# Altium schematic sheet JQ8900-16P语音模块原理图v1.1.SchDoc
size A3
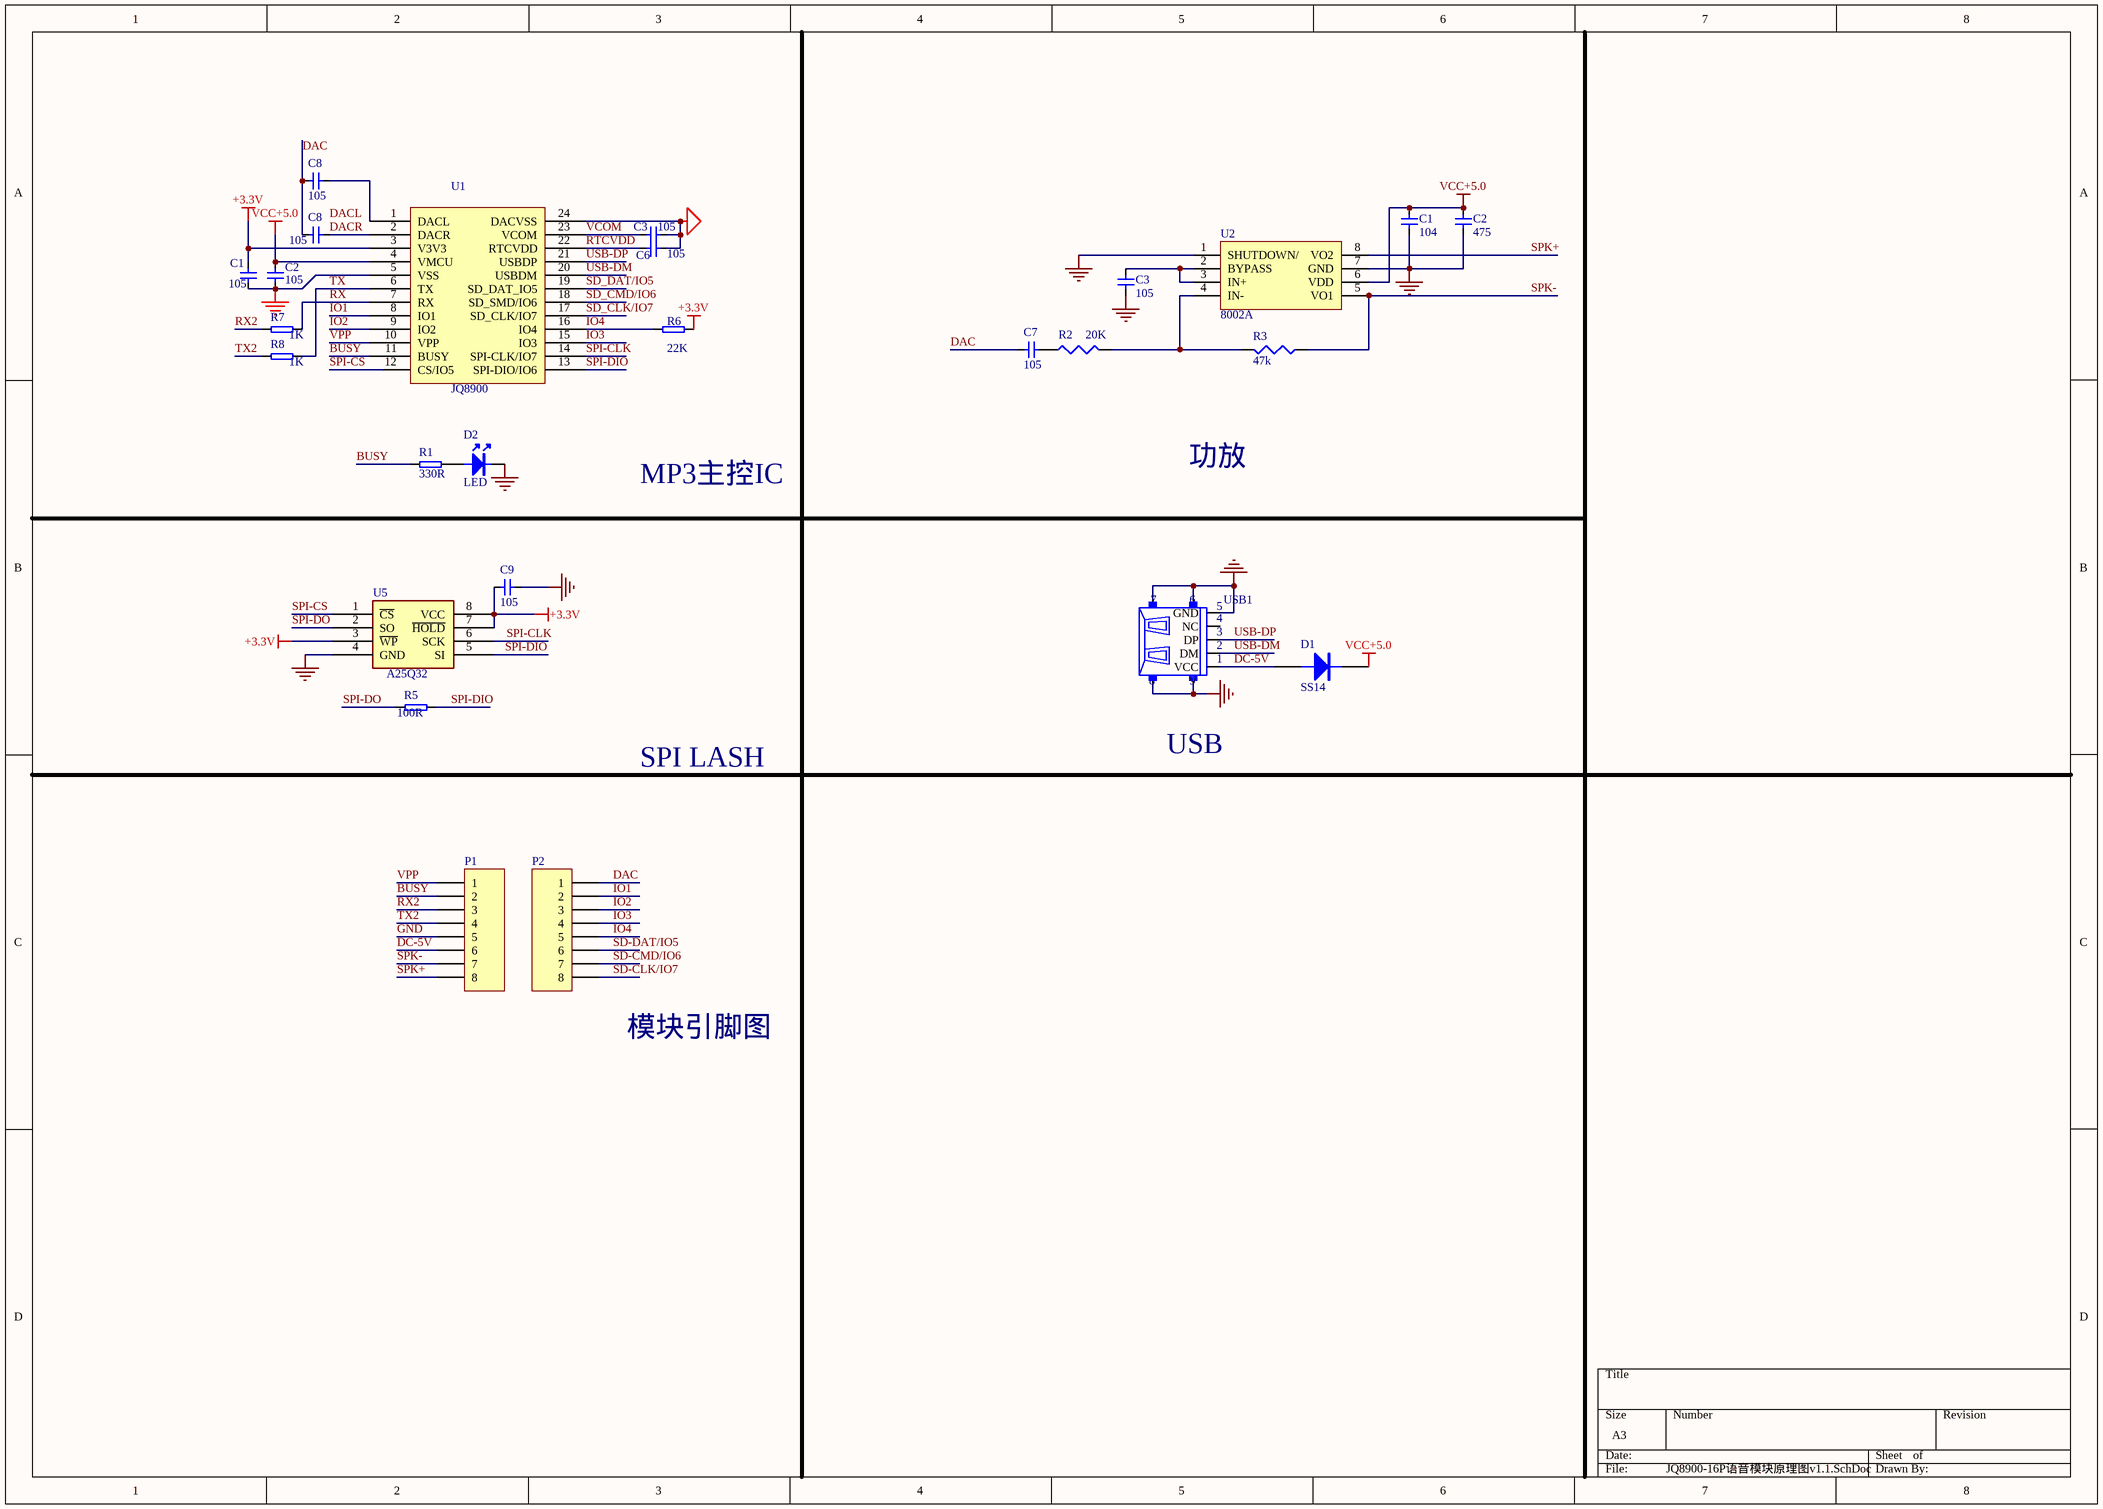
[diagram p0: JQ8900-16P语音模块原理图v1.1.SchDoc]

## Parts
(Parts that share a designator on the sheet are numbered #1, #2 ... from top to bottom, then left to right.)
C1#1  104  [C0603]
C1#2  105  [C0603]
C2#1  475  [C0603]
C2#2  105  [C0603]
C3#1  105  [C0603]
C3#2  105  [C0603]
C6  105  [C0603]
C7  105  [C0603]
C8#1  105  [C0603]
C8#2  105  [C0603]
C9  105  [C0603]
D1  SS14  [SOD123-1]
D2  LED  [0603]
P1  Header 8  [HDR1X8]  (value not drawn)
P2  Header 8  [HDR1X8]  (value not drawn)
R1  330R  [R0603]
R2  20K  [R0603]
R3  47k  [R0603]
R5  100R  [R0603]
R6  22K  [R0603]
R7  1K  [R0603]
R8  1K  [R0603]
U1  JQ8900
U2  8002A  [SOP_8]
U5  A25Q32  [W25X16]
USB1  USB-5PIN  [USB-5PIN]  (value not drawn)

## Nets
+3.3V: C1#2.1 C9.1 R6.1 U1.3(V3V3) U5.3(~{WP}) U5.7(~{HOLD}) U5.8(VCC)
GND: C1#1.1 C1#2.2 C2#1.1 C2#2.2 C3#2.1 C9.2 D2.2 P1.5 U1.5(VSS) U2.1(SHUTDOWN/) U2.7(GND) U5.4(GND) USB1.5(GND) USB1.6 USB1.7 USB1.8 USB1.9
SGND: C3#1.2 C6.2 U1.24(DACVSS)
VCC+5.0: C1#1.2 C2#1.2 C2#2.1 D1.2(K) U1.4(VMCU) U2.6(VDD)
BUSY: P1.2 R1.2 U1.11(BUSY)
DAC: C7.1 C8#1.1 C8#2.1 P2.1
DACR: C8#2.2 U1.2(DACR)
DC-5V: D1.1(A) P1.6 USB1.1(VCC)
IO1: P2.2 U1.8(IO1)
IO2: P2.3 U1.9(IO2)
IO3: P2.4 U1.15(IO3)
IO4: P2.5 R6.2 U1.16(IO4)
RTCVDD: C6.1 U1.22(RTCVDD)
RX: R7.1 U1.7(RX)
RX2: P1.3 R7.2
SD-CLK/IO7: P2.8
SD-CMD/IO6: P2.7
SD-DAT/IO5: P2.6
SD_CLK/IO7: U1.17(SD_CLK/IO7)
SD_CMD/IO6: U1.18(SD_SMD/IO6)
SD_DAT/IO5: U1.19(SD_DAT_IO5)
SPI-CLK: U1.14(SPI-CLK/IO7) U5.6(SCK)
SPI-CS: U1.12(CS/IO5) U5.1(~{CS})
SPI-DIO: R5.1 U1.13(SPI-DIO/IO6) U5.5(SI)
SPI-DO: R5.2 U5.2(SO)
SPK+: P1.8 U2.8(VO2)
SPK-: P1.7 R3.1 U2.5(VO1)
TX: R8.1 U1.6(TX)
TX2: P1.4 R8.2
USB-DM: U1.20(USBDM) USB1.2(DM)
USB-DP: U1.21(USBDP) USB1.3(DP)
VCOM: C3#1.1 U1.23(VCOM)
VPP: P1.1 U1.10(VPP)
NetC3#2_2: C3#2.2 U2.2(BYPASS) U2.3(IN+)
NetC7_2: C7.2 R2.1
NetC8#1_2: C8#1.2 U1.1(DACL)
NetD2_1: D2.1 R1.1
NetR2_2: R2.2 R3.2 U2.4(IN-)

Not connected (* = marked no-connect by the designer): USB1 4(NC)

## Notes on the sheet
- MP3主控IC
- 功放
- SPI LASH
- USB
- 模块引脚图
- Labels drawn without touching a wire or pin: DACL

## Library data of the parts
C1#1 C1#2 C2#1 C2#2 C3#1 C3#2 C6 C7 C8#1 C8#2 C9 = CAP: Capacitor
D1 = DIODE
P1 P2 = Header 8: Header, 8-Pin; LatestRevisionDate: 17-Jul-2002; LatestRevisionNote: Re-released for DXP Platform.; Publisher: Altium Limited
R1 R5-R8 = RES
R2 R3 = Res3: 0805.PcbLib; Published: 8-Jun-2000; LatestRevisionDate: 17-Jul-2002; LatestRevisionNote: Re-released for DXP Platform.; Publisher: Altium Limited
U1 = COMPONENT_2
U2 = LM4890